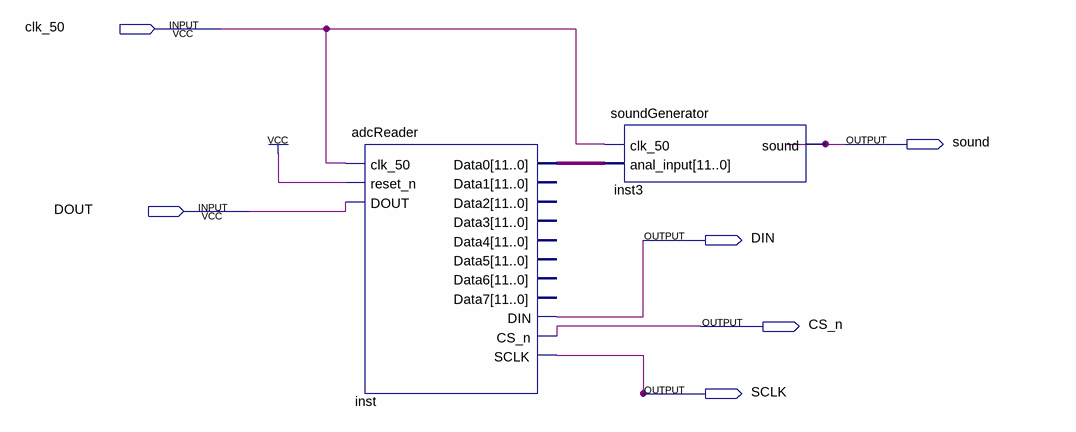
[diagram p0: schematic sheet]
// Quartus schematic Teil2.bdf as structural Verilog: 2 symbols, 6 pins
module Teil2 (
  input  clk_50,
  input  DOUT,
  output sound,
  output DIN,
  output CS_n,
  output SCLK
);

  wire [11:0] inst_data0;

  adcReader inst (
    .clk_50(clk_50), .reset_n(1'b1), .DOUT(DOUT), .Data0(inst_data0), .DIN(DIN), .CS_n(CS_n), .SCLK(SCLK));  // open: Data1, Data2, Data3, Data4, Data5, Data6, Data7
  soundGenerator inst3 (.clk_50(clk_50), .anal_input(inst_data0), .sound(sound));
endmodule
